# EAGLE design blanco3x5 (EAGLE 7.6.0)
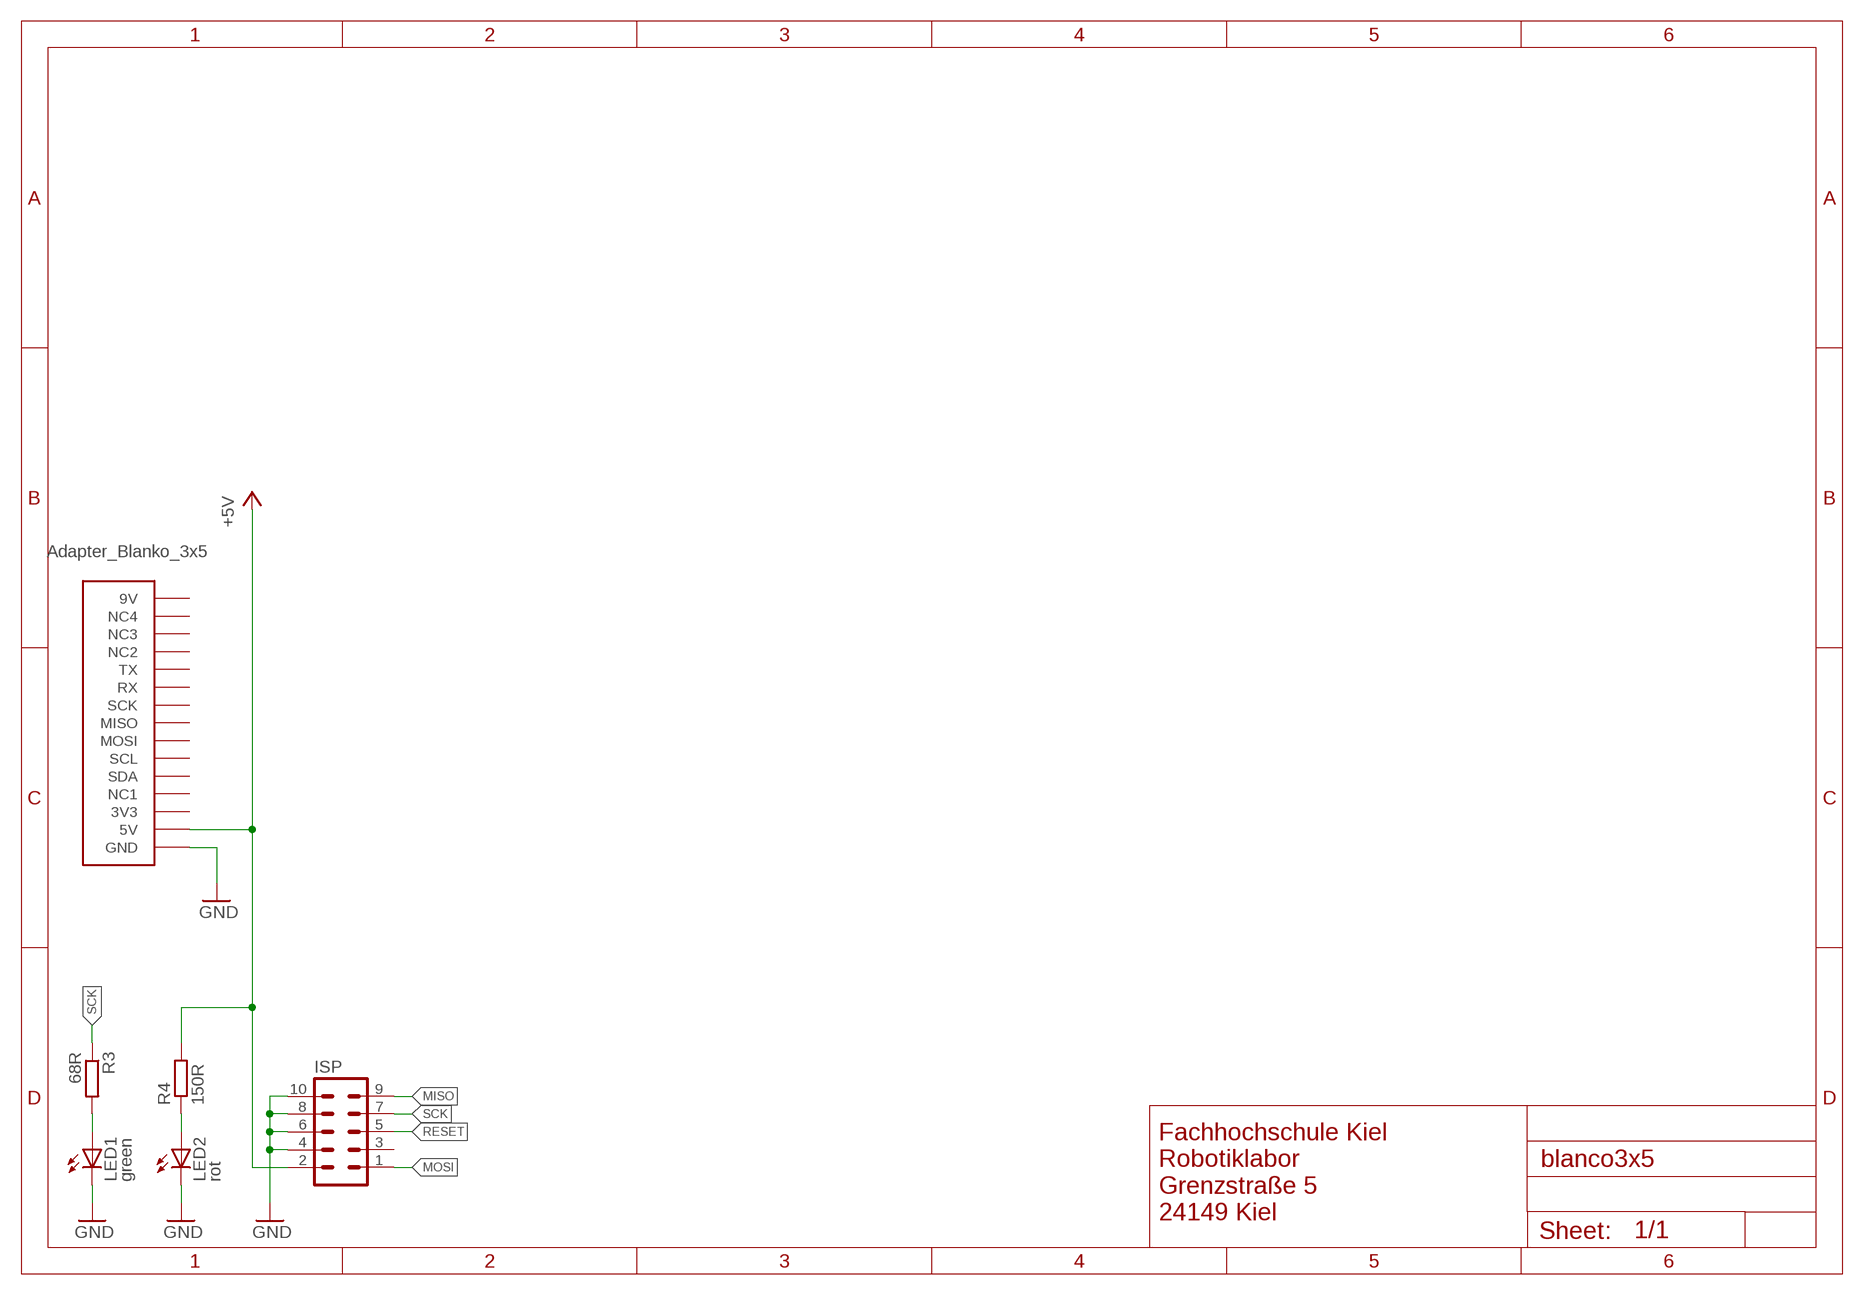
[diagram p0: schematic, sheet 1]

## Parts
ISP  ML10L  [ML10L]
LED1  green  LEDCHIP-LED0805  [CHIP-LED0805]
LED2  rot  LEDCHIP-LED0805  [CHIP-LED0805]
R3  68R  R-EU_R0805W  [R0805W]
R4  150R  R-EU_R0805W  [R0805W]
U$1  ADAPTER_BLANKO_3X5B2  [ADAPTER_BLANKO_3X5_B2]

## Nets
+5V: ISP.2 R4.2 U$1.5V U$1.5V_1(5V)
GND: ISP.4 ISP.6 ISP.8 ISP.10 LED1.C LED2.C U$1.GND U$1.GND1(GND) U$1.GND2(GND) U$1.GND3(GND)
MISO: ISP.9
MOSI: ISP.1
N$6: LED1.A R3.2
N$7: LED2.A R4.1
RESET: ISP.5
SCK: ISP.7 R3.1
Unconnected: ISP.3 U$1.3V3 U$1.3V3_1(3V3) U$1.9V U$1.9V_1(9V) U$1.MISO U$1.MISO_1(MISO) U$1.MOSI U$1.MOSI_1(MOSI) U$1.NC1 U$1.NC2 U$1.NC3 U$1.NC4 U$1.NC5(NC1) U$1.NC6(NC2) U$1.NC7(NC3) U$1.NC8(NC4) U$1.RX U$1.RX_1(RX) U$1.SCK U$1.SCK_1(SCK) U$1.SCL U$1.SCL_1(SCL) U$1.SDA U$1.SDA_1(SDA) U$1.TX U$1.TX_1(TX)

## Notes on the sheet
- Fachhochschule Kiel
  Robotiklabor
  Grenzstraße 5
  24149 Kiel

## Library data of the parts
ISP = con-ml:ML10L: HARTING; OC_FARNELL: unknown; OC_NEWARK: unknown
LED1 LED2 = led:LED: LED OSRAM: - CHIPLED LG R971, LG N971, LY N971, LG Q971, LY Q971, LO R971, LY R971 LH N974, LH R974 LS Q976, LO Q976, LY Q976 LO Q996 - Hyper CHIPLED LW Q18S LB Q993, LB Q99A, LB R99A - SideLED LS A670, LO A670, LY A670, LG A670, LP A670 LB A673, LV A673, LT A673, LW A673 LH A674 LY A675 LS A676, LA A676, LO A676, LY A676, LW A676 LS A679, LY A679, LG A679 - Hyper Micro SIDELED® LS Y876, LA Y876, LO Y876, LY Y876 LT Y87S - SmartLED LW L88C, LW L88S LB L89C, LB L89S, LG L890 LS L89K, LO L89K, LY L89K LS L896, LA L896, LO L896, LY L896 - TOPLED LS T670, LO T670, LY T670, LG T670, LP T670 LSG T670, LSP T670, LSY T670, LOP T670, LYG T670 LG T671, LOG T671, LSG T671 LB T673, LV T673, LT T673, LW T673 LH T674 LS T676, LA T676, LO T676, LY T676, LB T676, LH T676, LSB T676, LW T676 LB T67C, LV T67C, LT T67C, LS T67K, LO T67K, LY T67K, LW E67C LS E67B, LA E67B, LO E67B, LY E67B, LB E67C, LV E67C, LT E67C LW T67C LS T679, LY T679, LG T679 LS T770, LO T770, LY T770, LG T770, LP T770 LB T773, LV T773, LT T773, LW T773 LH T774 LS E675, LA E675, LY E675, LS T675 LS T776, LA T776, LO T776, LY T776, LB T776 LHGB T686 LT T68C, LB T68C - Hyper Mini TOPLED® LB M676 - Mini TOPLED Santana® LG M470 LS M47K, LO M47K, LY M47K Source: http://www.osram.convergy.de LUXEON: - LUMILED® LXK2-PW12-R00, LXK2-PW12-S00, LXK2-PW14-U00, LXK2-PW14-V00 LXK2-PM12-R00, LXK2-PM12-S00, LXK2-PM14-U00 LXK2-PE12-Q00, LXK2-PE12-R00, LXK2-PE12-S00, LXK2-PE14-T00, LXK2-PE14-U00 LXK2-PB12-K00, LXK2-PB12-L00, LXK2-PB12-M00, LXK2-PB14-N00, LXK2-PB14-P00, LXK2-PB14-Q00 LXK2-PR12-L00, LXK2-PR12-M00, LXK2-PR14-Q00, LXK2-PR14-R00 LXK2-PD12-Q00, LXK2-PD12-R00, LXK2-PD12-S00 LXK2-PH12-R00, LXK2-PH12-S00 LXK2-PL12-P00, LXK2-PL12-Q00, LXK2-PL12-R00 Source: www.luxeon.com KINGBRIGHT: KA-3528ASYC Source: www.kingbright.com
R3 R4 = rcl:R-EU_: RESISTOR, European symbol
U$1 = Tim:ADAPTER_BLANKO_3X5: B1 = Beschriftung innen B2 = Beschriftung aussen

## Board
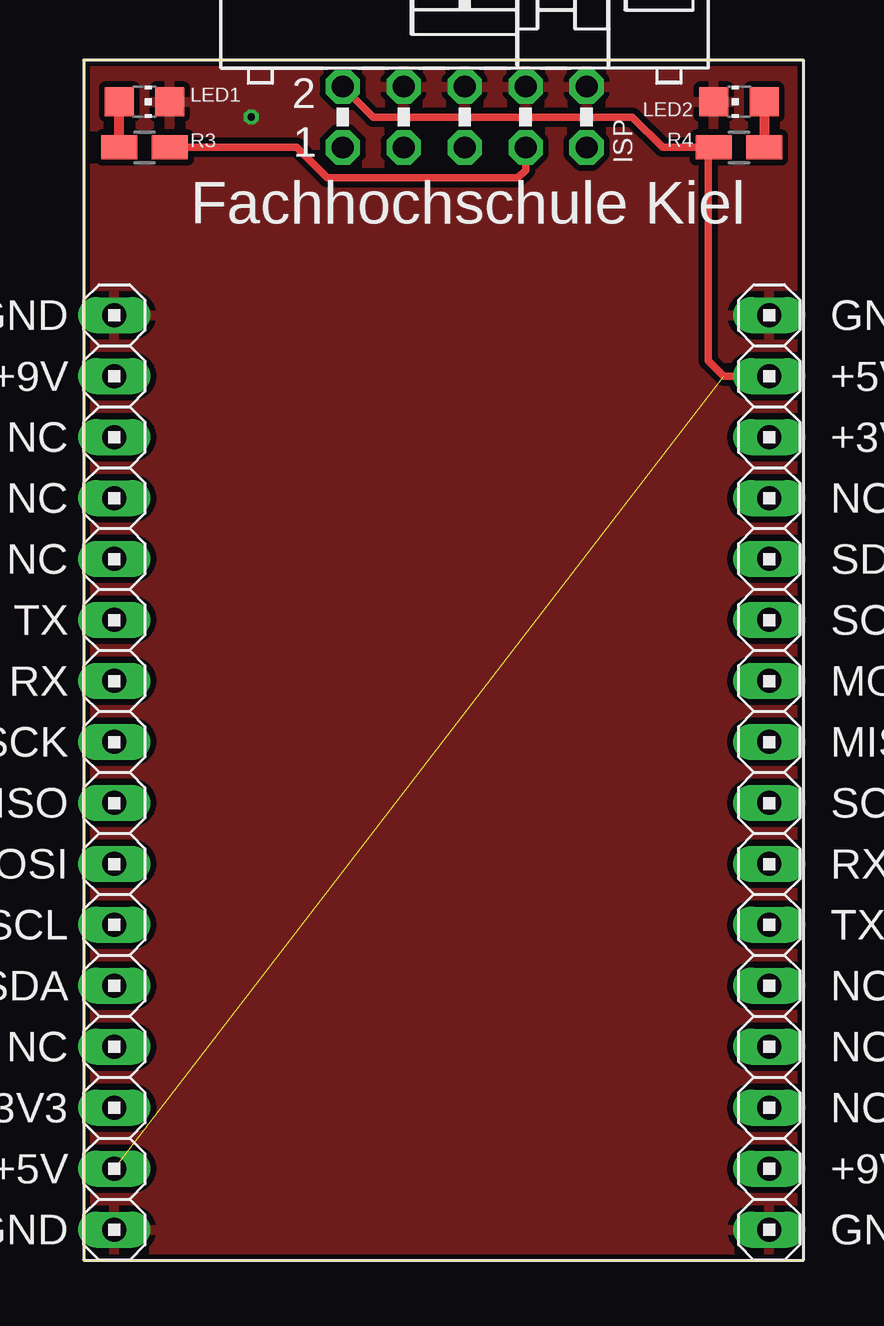
[diagram p1: board, top side]
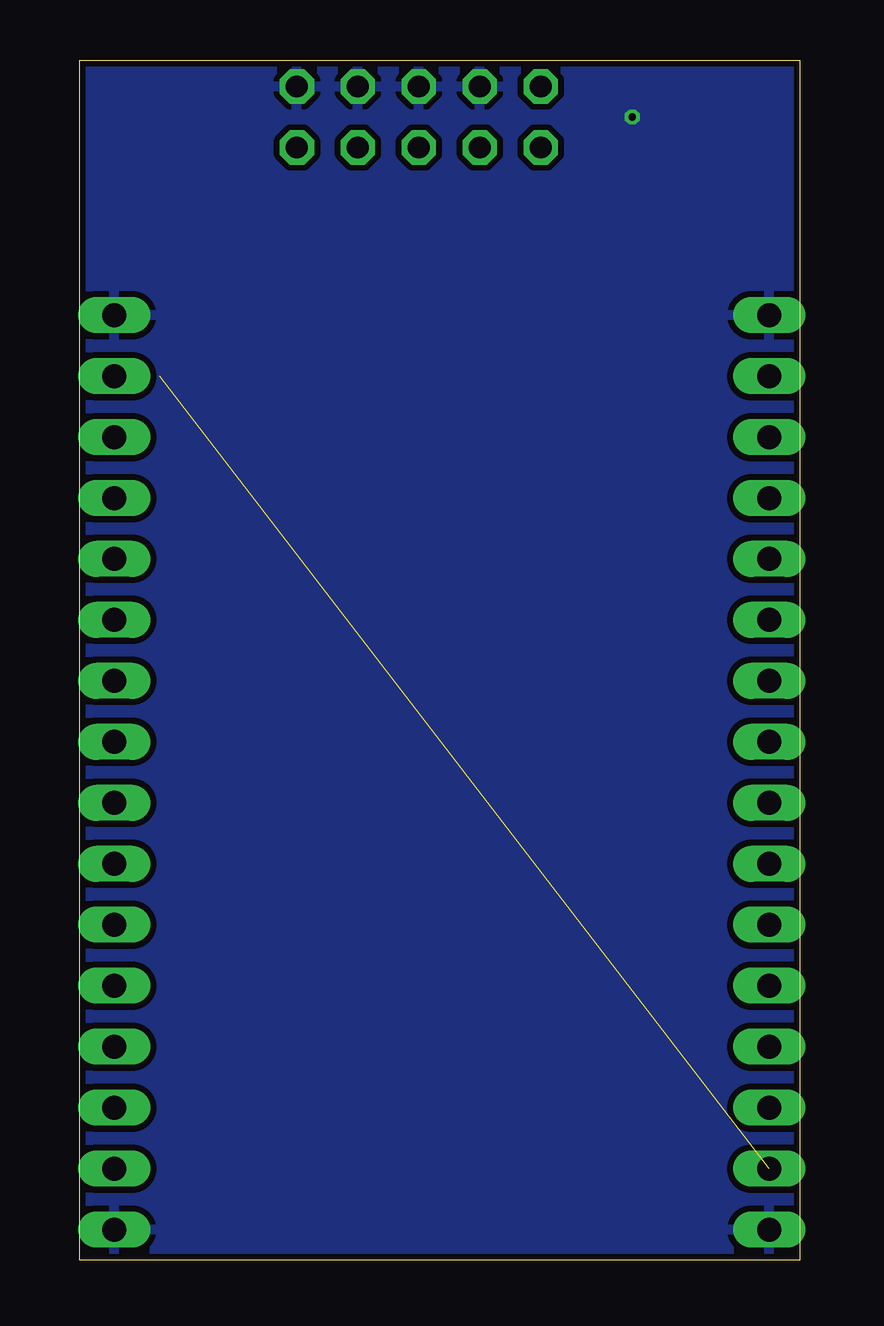
[diagram p2: board, bottom side, seen from below]

Size 30 x 50 mm. Coordinates in mm from the lower left corner, seen from the top.
Outline: 0,0 30,0 30,50 0,50 0,0
Copper layers (1*16): Top 0.035mm / dielectric 1.5mm / Bottom 0.035mm
Design rules "dirt_cheap_dirty_boards.v1": minimum track width 5mil, minimum drill 12mil, track to track 5mil, track to pad 5mil, pad to pad 5mil, via to via 5mil, smd to smd 0mil, copper to edge 10mil, drill to drill 10mil, minimum pad ring 10mil, minimum via ring 6mil, stop-mask expansion 2mil, vias tented up to drill 25mil, thermal gap 10mil

### Footprints (pad centres in the part's own frame; a part is rotated, then mirrored left to right if it is on the bottom)
ML10L = drill 0.914 octagon: 1 -5.08,-1.27; 2 -5.08,1.27; 3 -2.54,-1.27; 4 -2.54,1.27; 5 0,-1.27; 6 0,1.27; 7 2.54,-1.27; 8 2.54,1.27; 9 5.08,-1.27; 10 5.08,1.27
CHIP-LED0805 = smd 1.2 x 1.2: A 0,-1.05; C 0,1.05
R0805W = smd 1.5 x 1: 1 -1.052,0; 2 1.052,0
ADAPTER_BLANKO_3X5_B2 = drill 1 long: 3V3 1.278,6.349; 3V3_1 28.566,34.289; 5V 1.278,3.809; 5V_1 28.566,36.829; 9V 1.278,36.829; 9V_1 28.566,3.809; GND 1.278,1.269; GND1 1.278,39.369; GND2 28.566,39.369; GND3 28.566,1.269; MISO 1.278,19.049; MISO_1 28.566,21.589; MOSI 1.278,16.509; MOSI_1 28.566,24.129; NC1 1.278,8.889; NC2 1.278,29.209; NC3 1.278,31.749; NC4 1.278,34.289; NC5 28.566,31.749; NC6 28.566,11.429; NC7 28.566,8.889; NC8 28.566,6.349; RX 1.278,24.129; RX_1 28.566,16.509; SCK 1.278,21.589; SCK_1 28.566,19.049; SCL 1.278,13.969; SCL_1 28.566,26.669; SDA 1.278,11.429; SDA_1 28.566,29.209; TX 1.278,26.669; TX_1 28.566,13.969

### Placement (x,y rotation side)
ISP  15.88,47.62 0 top
LED1  2.54,48.26 270 top
LED2  27.3,48.26 90 top
R3  2.54,46.35 180 top
R4  27.3,46.35 180 top
U$1  0,0 0 top

### Tracks (layer width: path | path; a pad name or v marks a point on that pad's centre or on a via)
+5V  (1 unrouted)
  Top 0.305: ISP.2 12.06,47.62 22.86,47.62 24.13,46.35 R4.2 26.04,46.14 26.04,37.47 26.67,36.83 U$1.5V_1
GND  (via drill 0.3)
  other vias: 6.99,47.62
  pour Bottom (isolate 0.254): 0,0 29.84,0 29.84,50.16 0,50.16
  pour Top (isolate 0.254): 0,0 29.84,0 29.84,50.16 0,50.16
N$6
  Top 0.406: R3.2 LED1.A
N$7
  Top 0.406: LED2.A R4.1
SCK
  Top 0.305: R3.1 8.89,46.35 10.16,45.09 18.1,45.09 18.41,45.4 ISP.7

### Text on the board
tNames: Fachhochschule Kiel